# EAGLE schematic short_detec (EAGLE 9.6.2)
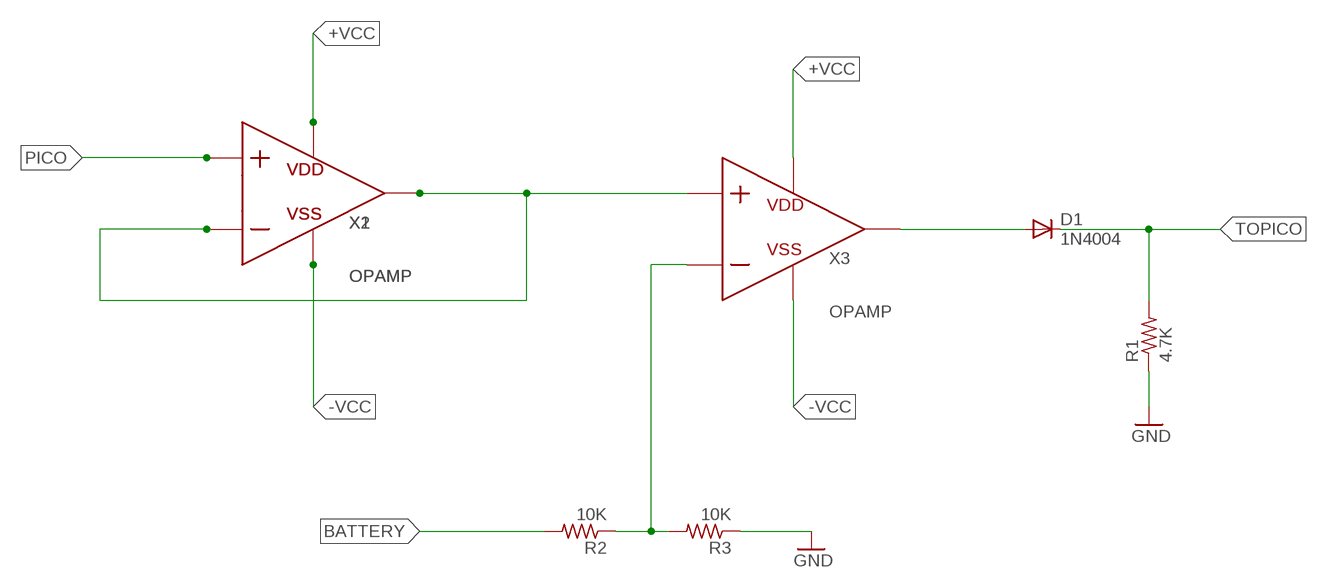
[diagram p0: schematic, sheet 1]

## Parts
D1  1N4004  [DO41-10]
R1  4.7K  R-US_R0805  [R0805]
R2  10K  R-US_R0805  [R0805]
R3  10K  R-US_R0805  [R0805]
X1  OPAMP  (no package)
X2  OPAMP  (no package)
X3  OPAMP  (no package)

## Nets
+VCC: X1.VDD X2.VDD X3.VDD
-VCC: X1.VSS X2.VSS X3.VSS
BATTERY: R2.2
GND: R1.1 R3.1
N$1: D1.A X3.VOUT
N$2: X1.N X1.VOUT X2.N X2.VOUT X3.P
N$5: R2.1 R3.2 X3.N
PICO: X1.P X2.P
TOPICO: D1.C R1.2

## Library data of the parts
D1 = adafruit:1N4004: DIODE General purpose 1N400x type rectifier (With bigger pads) http://www.ladyada.net/library/pcb/eaglelibrary.html
R1-R3 = rcl:R-US_: RESISTOR, American symbol; SPICEPREFIX: R
X1-X3 = ngspice-simulation:OPAMP: Operational amplifier with power pins